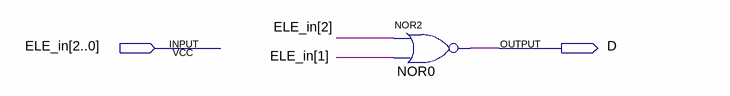
[diagram p0: schematic sheet]
// Quartus schematic DECOD_ELE_D.bdf as structural Verilog: 1 symbols, 2 pins
module DECOD_ELE_D (
  input  [2:0] ELE_in,
  output D
);

  nor NOR0 (D, ELE_in[2], ELE_in[1]);
endmodule
